# Altium schematic sheet analog.SchDoc
size 381 x 241 mm; SheetNumber: 8; SheetTotal: 13
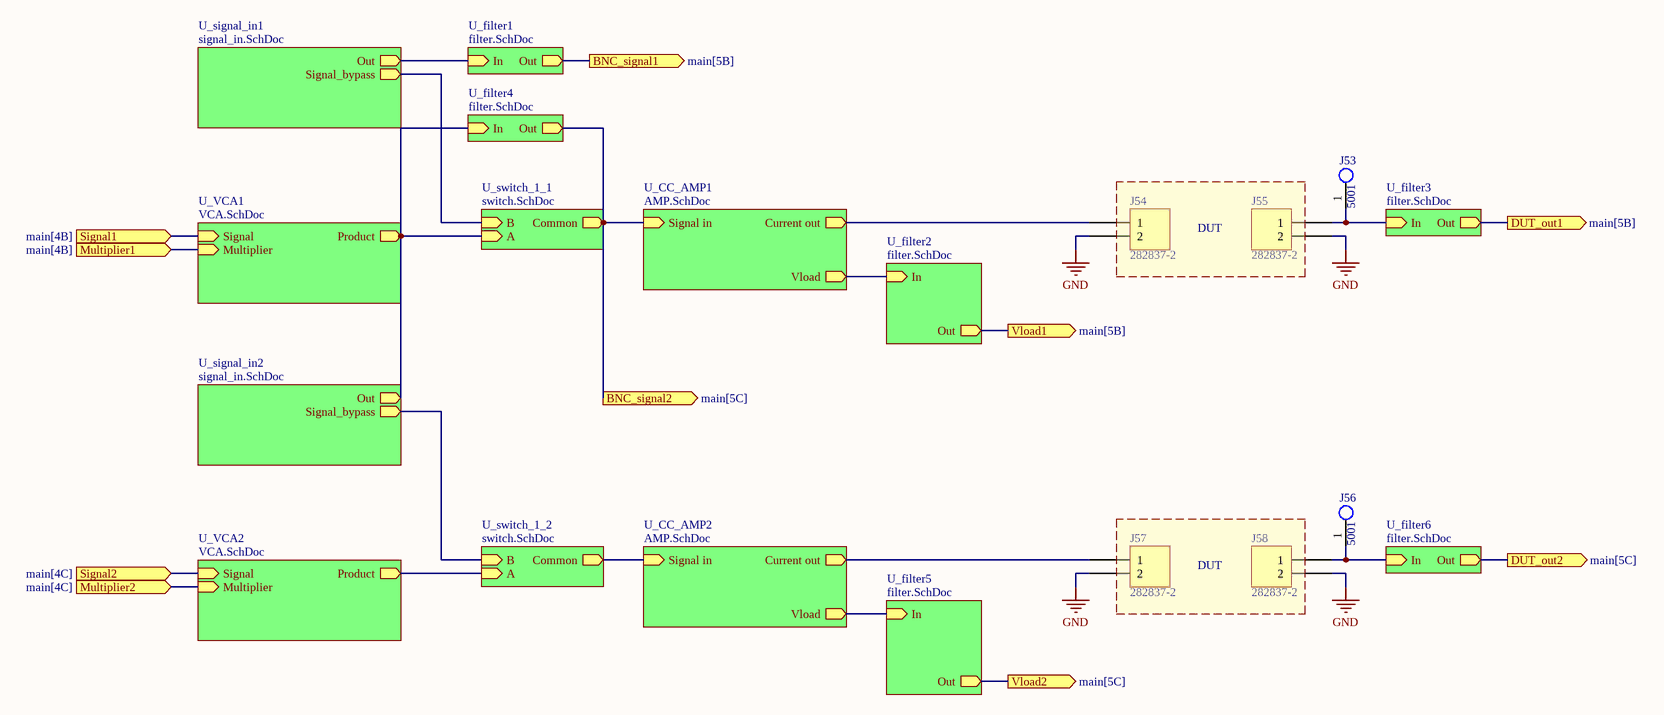
[diagram p0: analog.SchDoc]

## Parts
J53  5001  [FP-5001-MFG]
J54  282837-2  [TE 282837-2]
J55  282837-2  [TE 282837-2]
J56  5001  [FP-5001-MFG]
J57  282837-2  [TE 282837-2]
J58  282837-2  [TE 282837-2]

## Blocks framed on the sheet
DUT: J54 J55
DUT: J57 J58

## Sub-sheets
U_CC_AMP1 = AMP.SchDoc: Current out (out), Vload (out), Signal in (in)
U_CC_AMP2 = AMP.SchDoc: Current out (out), Vload (out), Signal in (in)
U_filter1 = filter.SchDoc: Out (out), In (in)
U_filter2 = filter.SchDoc: Out (out), In (in)
U_filter3 = filter.SchDoc: Out (out), In (in)
U_filter4 = filter.SchDoc: Out (out), In (in)
U_filter5 = filter.SchDoc: Out (out), In (in)
U_filter6 = filter.SchDoc: Out (out), In (in)
U_signal_in1 = signal_in.SchDoc: Out (out), Signal_bypass (out)
U_signal_in2 = signal_in.SchDoc: Out (out), Signal_bypass (out)
U_switch_1_1 = switch.SchDoc: B (in), A (in), Common (out)
U_switch_1_2 = switch.SchDoc: B (in), A (in), Common (out)
U_VCA1 = VCA.SchDoc: Product (out), Signal (in), Multiplier (in)
U_VCA2 = VCA.SchDoc: Product (out), Signal (in), Multiplier (in)

## Ports
BNC_signal1 (out, see main[5B]), BNC_signal2 (out, see main[5C]), DUT_out1 (out, see main[5B]), DUT_out2 (out, see main[5C]), Multiplier1 (in, see main[4B]), Multiplier2 (in, see main[4C]), Signal1 (in, see main[4B]), Signal2 (in, see main[4C]), Vload1 (out, see main[5B]), Vload2 (out, see main[5C])

## Nets
GND: J54.2 J55.2 J57.2 J58.2
BNC_signal1: port BNC_signal1, sheet U_filter1/Out
BNC_signal2: port BNC_signal2, sheet U_CC_AMP1/Signal in, sheet U_filter4/Out, sheet U_switch_1_1/Common
DUT_out1: port DUT_out1, sheet U_filter3/Out
DUT_out2: port DUT_out2, sheet U_filter6/Out
Multiplier1: port Multiplier1, sheet U_VCA1/Multiplier
Multiplier2: port Multiplier2, sheet U_VCA2/Multiplier
Signal1: port Signal1, sheet U_VCA1/Signal
Signal2: port Signal2, sheet U_VCA2/Signal
Vload1: port Vload1, sheet U_filter2/Out
Vload2: port Vload2, sheet U_filter5/Out
NetJ53_1: J53.1 J55.1 ; sheet U_filter3/In
NetJ54_1: J54.1 ; sheet U_CC_AMP1/Current out
NetJ56_1: J56.1 J58.1 ; sheet U_filter6/In
NetJ57_1: J57.1 ; sheet U_CC_AMP2/Current out
(unnamed): sheet U_CC_AMP1/Vload, sheet U_filter2/In
(unnamed): sheet U_VCA1/Product, sheet U_signal_in2/Out, sheet U_filter4/In, sheet U_switch_1_1/A
(unnamed): sheet U_CC_AMP2/Vload, sheet U_filter5/In
(unnamed): sheet U_CC_AMP2/Signal in, sheet U_switch_1_2/Common
(unnamed): sheet U_VCA2/Product, sheet U_switch_1_2/A
(unnamed): sheet U_signal_in1/Out, sheet U_filter1/In
(unnamed): sheet U_signal_in1/Signal_bypass, sheet U_switch_1_1/B
(unnamed): sheet U_signal_in2/Signal_bypass, sheet U_switch_1_2/B

## Library data of the parts
J53 J56 = CMP-2000-05181-2: PC TEST POINT MINIATURE BLACK; Body Material: Bronze; Plating: Silver; Inside Diameter: 1.27mm; Hole Diameter: 1.6mm; Number of Ports: 1; Outside Diameter: 2.54mm; Insulation: Insulated; Insulation Material: Nylon; Mount: Through Hole; RoHS Compliant: Yes; Series: THM; Height: 0.3inch; Termination: Through Hole; Material: Nylon; Packaging: Bulk; Contact Material: Bronze; REACH SVHC: No SVHC; Contact Plating: Silver; Orientation: Straight; Lead Free: Lead Free; Package Quantity: 100; Length: 7.62mm; Flammability Rating: UL94 V-0; Number of Contacts: 1; Diameter: 2.54mm; Housing Color: Black; Color: Black
J54 J55 J57 J58 = 282837-2: TERM BLK 2P SIDE ENT 5.08MM PCB; Manufacturer: TE Connectivity AMP Connectors; Current: 13.5 A; Mating Orientation: Horizontal with Board; Number of Levels: 1; Pitch: 0.200" (5.08mm); Positions Per Level: 2; Voltage: 300 V; Wire Gauge: 16-28 AWG; Wire Termination: Screw - Rising Cage Clamp; Part Number: 282837-2; Color: Green; ComponentLink1Description: Datasheet; ComponentLink1URL: https://www.te.com/commerce/DocumentDelivery/DDEController?Action=srchrtrv&DocNm=282837&DocType=Customer+Drawing&DocLang=English; ComponentLink2Description: DigiKey Link; ComponentLink2URL: https://www.digikey.com/en/products/detail/te-connectivity-amp-connectors/282837-2/2187973; Features: Interlocking (Side); LastUpdated: 6/21/2022 15:00:23; Lifecycle Status: Active; Minimum Order: 1; Mounting Type: Through Hole; Packaging: Tray; Part Status: Active; Price: 0.31; Series: Buchanan; Supplier 1: DigiKey; Supplier Part Number 1: A113320-ND